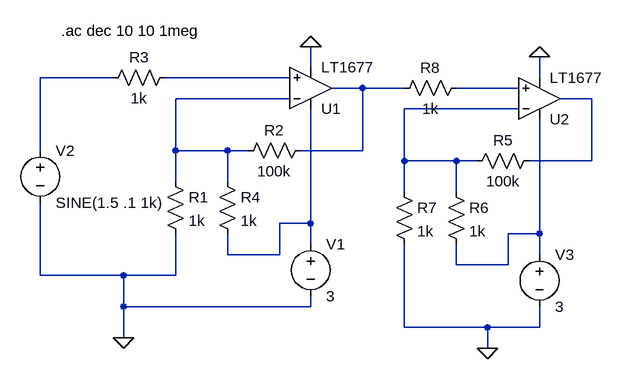
[diagram p0: schematic Amplifier.asc]
Amplifier.asc, the LTspice schematic file:
Version 4
SHEET 1 952 768
WIRE 496 256 496 224
WIRE 192 272 80 272
WIRE 464 272 272 272
WIRE 848 272 848 240
WIRE 576 288 528 288
WIRE 640 288 576 288
WIRE 816 288 720 288
WIRE 464 304 288 304
WIRE 928 304 880 304
WIRE 816 320 640 320
WIRE 80 384 80 272
WIRE 288 384 288 304
WIRE 368 384 288 384
WIRE 400 384 368 384
WIRE 576 384 576 288
WIRE 576 384 480 384
WIRE 640 400 640 320
WIRE 720 400 640 400
WIRE 752 400 720 400
WIRE 928 400 928 304
WIRE 928 400 832 400
WIRE 288 432 288 384
WIRE 368 432 368 384
WIRE 640 448 640 400
WIRE 720 448 720 400
WIRE 496 496 496 320
WIRE 496 496 448 496
WIRE 848 512 848 336
WIRE 848 512 800 512
WIRE 496 528 496 496
WIRE 368 544 368 512
WIRE 448 544 448 496
WIRE 448 544 368 544
WIRE 848 544 848 512
WIRE 720 560 720 528
WIRE 800 560 800 512
WIRE 800 560 720 560
WIRE 80 576 80 464
WIRE 208 576 80 576
WIRE 288 576 288 512
WIRE 288 576 208 576
WIRE 208 624 208 576
WIRE 496 624 496 608
WIRE 496 624 208 624
WIRE 640 656 640 528
WIRE 768 656 640 656
WIRE 848 656 848 624
WIRE 848 656 768 656
WIRE 208 672 208 624
WIRE 768 688 768 656
FLAG 496 224 0
FLAG 208 672 0
FLAG 848 240 0
FLAG 768 688 0
SYMBOL Opamps/LT1677 496 352 M180
SYMATTR InstName U1
SYMBOL voltage 496 512 R0
SYMATTR InstName V1
SYMATTR Value 3
SYMBOL res 272 416 R0
SYMATTR InstName R1
SYMATTR Value 1k
SYMBOL res 496 368 R90
WINDOW 0 0 56 VBottom 2
WINDOW 3 32 56 VTop 2
SYMATTR InstName R2
SYMATTR Value 100k
SYMBOL voltage 80 368 R0
SYMATTR InstName V2
SYMATTR Value SINE(1.5 .1 1k)
SYMATTR Value2 AC .00001
SYMBOL res 288 256 R90
WINDOW 0 0 56 VBottom 2
WINDOW 3 32 56 VTop 2
SYMATTR InstName R3
SYMATTR Value 1k
SYMBOL res 352 416 R0
SYMATTR InstName R4
SYMATTR Value 1k
SYMBOL Opamps/LT1677 848 368 M180
SYMATTR InstName U2
SYMBOL voltage 848 528 R0
SYMATTR InstName V3
SYMATTR Value 3
SYMBOL res 848 384 R90
WINDOW 0 0 56 VBottom 2
WINDOW 3 32 56 VTop 2
SYMATTR InstName R5
SYMATTR Value 100k
SYMBOL res 704 432 R0
SYMATTR InstName R6
SYMATTR Value 1k
SYMBOL res 624 432 R0
SYMATTR InstName R7
SYMATTR Value 1k
SYMBOL res 736 272 R90
WINDOW 0 0 56 VBottom 2
WINDOW 3 32 56 VTop 2
SYMATTR InstName R8
SYMATTR Value 1k
TEXT 112 200 Left 2 !.ac dec 10 10 1meg

The netlist it stands for:
* Amplifier.asc
XU1 N002 N005 N008 0 N003 LT1677  ; pins In+ In- V+ V- OUT
V1 N008 0 3
R1 N005 0 1k
R2 N003 N005 100k
V2 N001 0 SINE(1.5 .1 1k) AC .00001
R3 N002 N001 1k
R4 N005 N008 1k
XU2 N004 N007 N009 0 N006 LT1677  ; pins In+ In- V+ V- OUT
V3 N009 0 3
R5 N006 N007 100k
R6 N007 N009 1k
R7 N007 0 1k
R8 N004 N003 1k
.ac dec 10 10 1meg
.lib LTC.lib
.backanno
.end